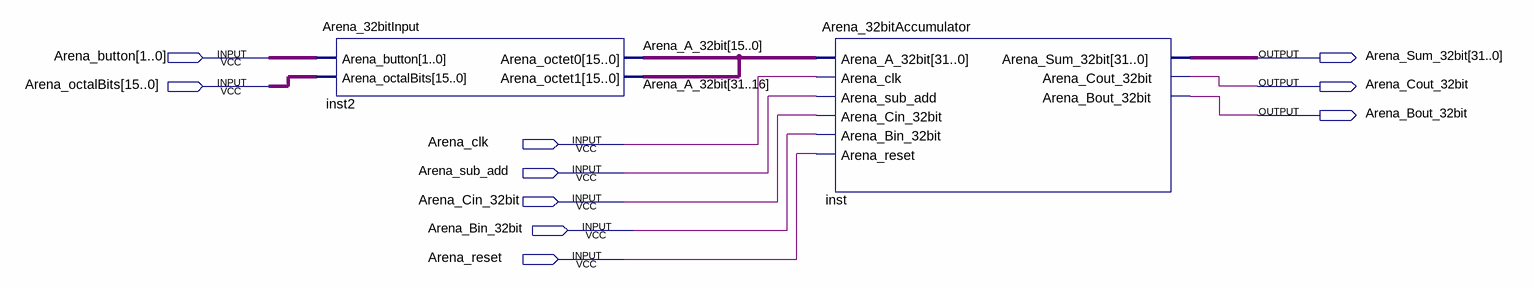
[diagram p0: schematic sheet]
// Quartus schematic Arena_32bitAccumulator_circuit.bdf as structural Verilog: 2 symbols, 10 pins
module Arena_32bitAccumulator_circuit (
  input  [1:0] Arena_button,
  input  [15:0] Arena_octalBits,
  input  Arena_clk,
  input  Arena_sub_add,
  input  Arena_Cin_32bit,
  input  Arena_Bin_32bit,
  input  Arena_reset,
  output [31:0] Arena_Sum_32bit,
  output Arena_Cout_32bit,
  output Arena_Bout_32bit
);

  wire [31:0] Arena_A_32bit;

  Arena_32bitInput inst2 (
    .Arena_button(Arena_button), .Arena_octalBits(Arena_octalBits), .Arena_octet0(Arena_A_32bit[15:0]),
    .Arena_octet1(Arena_A_32bit[31:16]));
  Arena_32bitAccumulator inst (
    .Arena_A_32bit(Arena_A_32bit), .Arena_clk(Arena_clk), .Arena_sub_add(Arena_sub_add),
    .Arena_Cin_32bit(Arena_Cin_32bit), .Arena_Bin_32bit(Arena_Bin_32bit), .Arena_reset(Arena_reset),
    .Arena_Sum_32bit(Arena_Sum_32bit), .Arena_Cout_32bit(Arena_Cout_32bit),
    .Arena_Bout_32bit(Arena_Bout_32bit));
endmodule
